# EAGLE schematic Functional_Schematic (EAGLE 9.6.2)
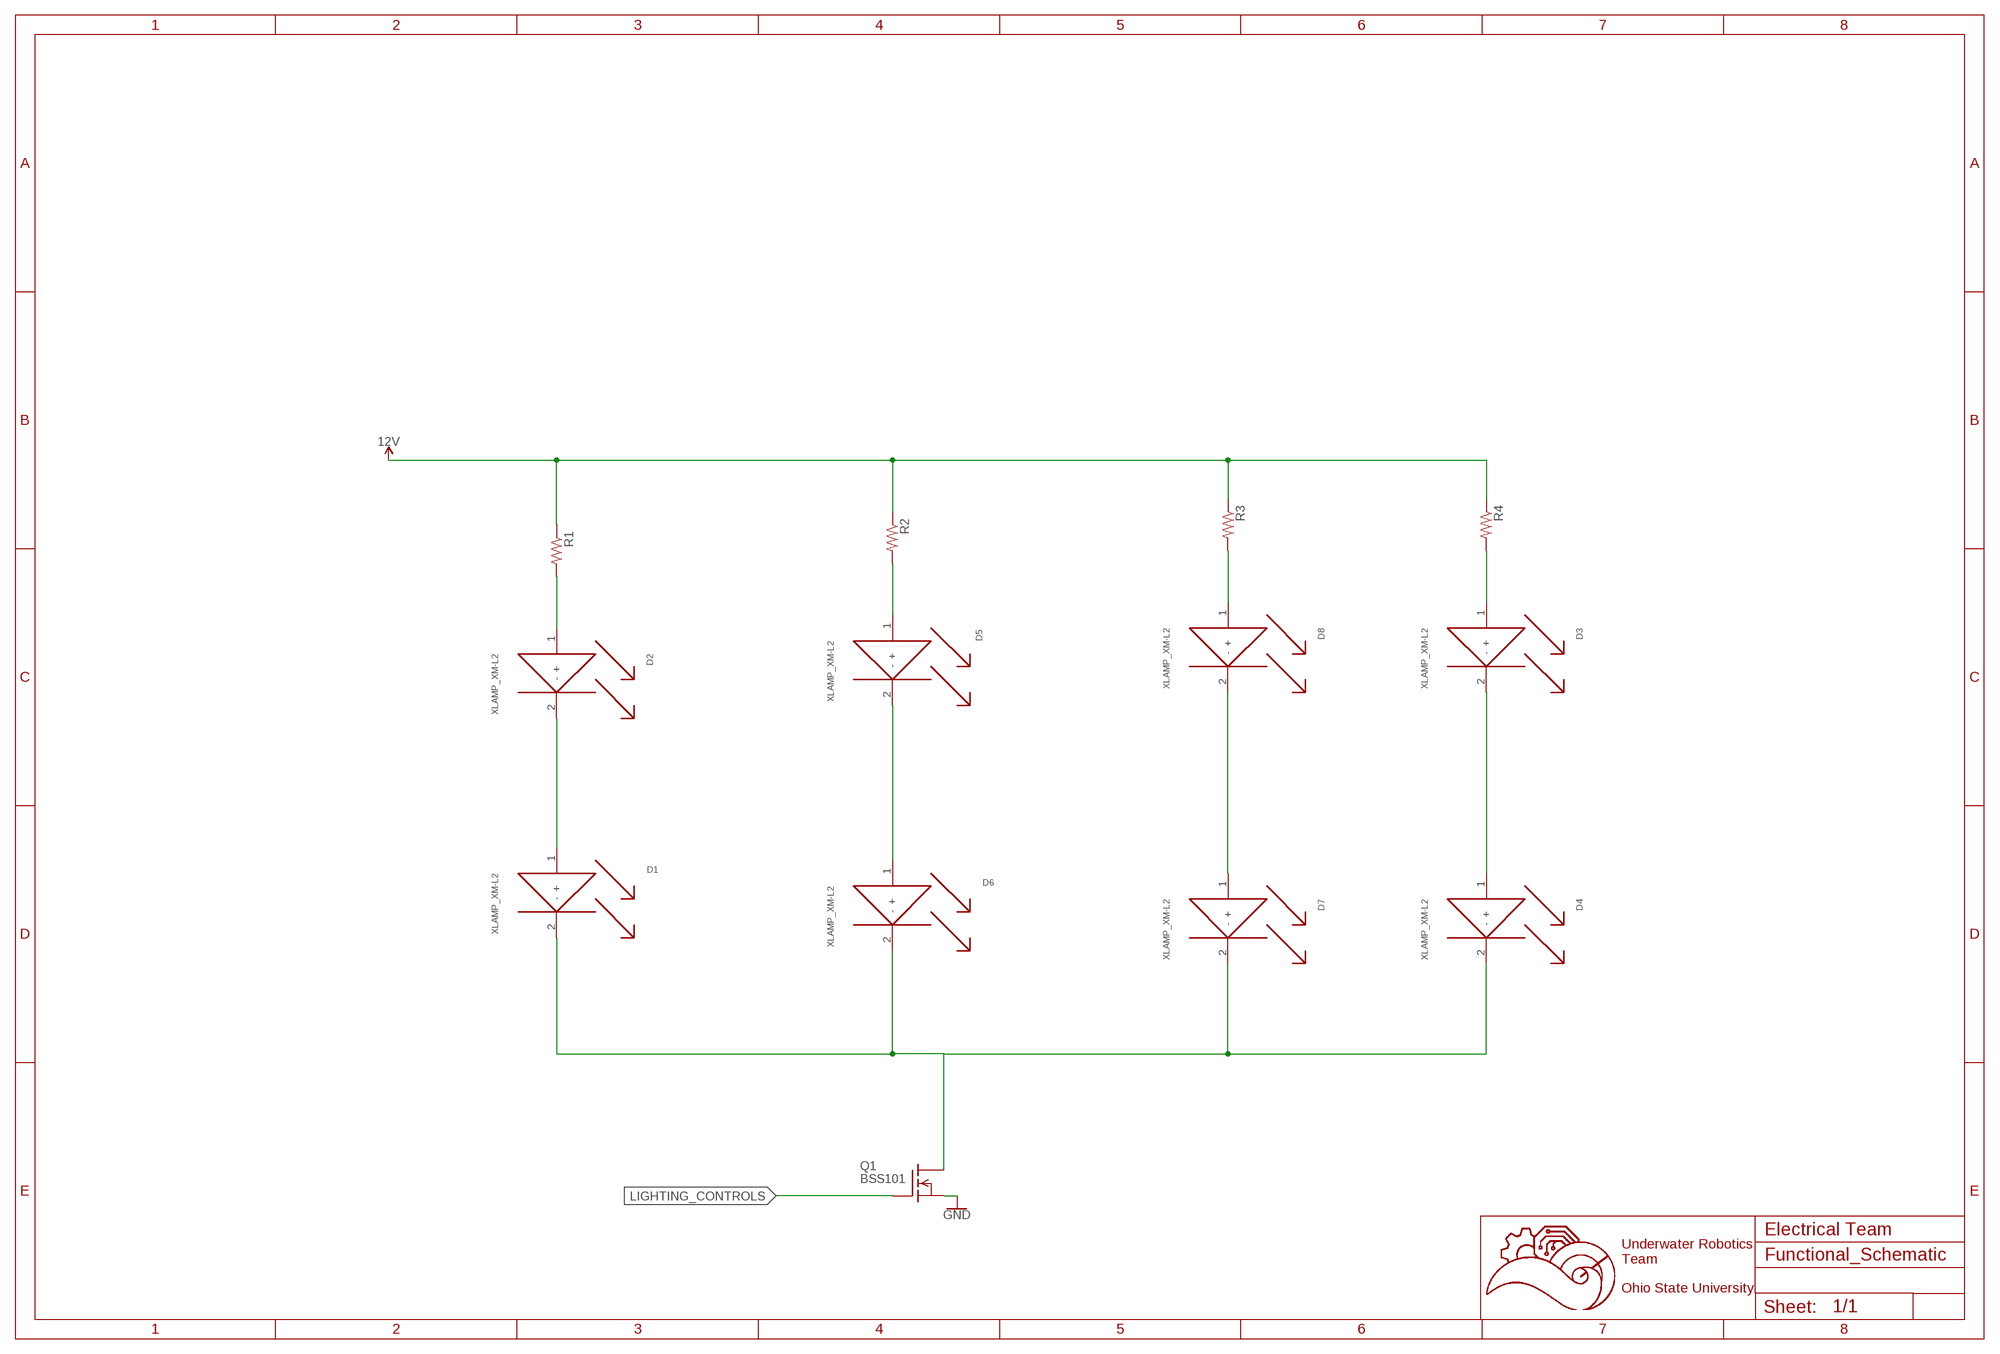
[diagram p0: schematic, sheet 1]

## Parts
D1  XLAMP_XM-L2  [XLAMP_XM-L2]
D2  XLAMP_XM-L2  [XLAMP_XM-L2]
D3  XLAMP_XM-L2  [XLAMP_XM-L2]
D4  XLAMP_XM-L2  [XLAMP_XM-L2]
D5  XLAMP_XM-L2  [XLAMP_XM-L2]
D6  XLAMP_XM-L2  [XLAMP_XM-L2]
D7  XLAMP_XM-L2  [XLAMP_XM-L2]
D8  XLAMP_XM-L2  [XLAMP_XM-L2]
Q1  BSS101  [TO92]
R1  R-US_R0603  [R0603]
R2  R-US_R0603  [R0603]
R3  R-US_R0603  [R0603]
R4  R-US_R0603  [R0603]

## Nets
12V: R1.1 R2.1 R3.1 R4.1
GND: Q1.1(S)
LIGHTING_CONTROLS: Q1.2(G)
N$1: D1.1(+) D2.2(-)
N$2: D5.2(-) D6.1(+)
N$3: D7.1(+) D8.2(-)
N$4: D3.2(-) D4.1(+)
N$5: D2.1(+) R1.2
N$6: D5.1(+) R2.2
N$7: D8.1(+) R3.2
N$8: D3.1(+) R4.2
N$9: D1.2(-) D4.2(-) D6.2(-) D7.2(-) Q1.3(D)

## Notes on the sheet
- Electrical Team
- Underwater Robotics
  Team
  
  Ohio State University

## Library data of the parts
D1-D8 = CreeXLamp_XM-L2:XLAMP_XM-L2
Q1 = transistor-fet:BSS101: N-Channel Enhancement MOSFET 200V; 0,16A; 11Ohm
R1-R4 = rcl:R-US_: RESISTOR, American symbol; SPICEPREFIX: R